# EAGLE schematic NESpi (EAGLE 7.7.0)
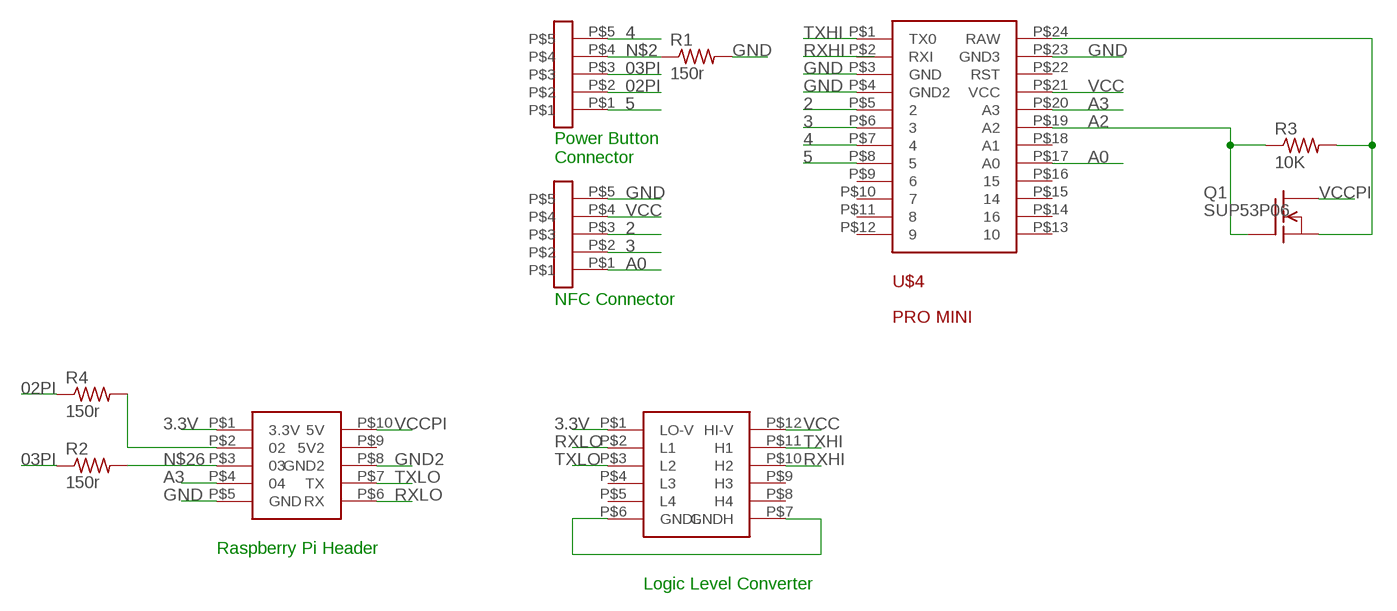
[diagram p0: schematic, sheet 1]

## Parts
Q1  SUP53P06  IRF620  [TO220]
R1  150r  R-US_VMTA55  [VMTA55]
R2  150r  R-US_VMTA55  [VMTA55]
R3  10K  R-US_VMTA55  [VMTA55]
R4  150r  R-US_VMTA55  [VMTA55]
U$1  DIP5  [DIP5]
U$3  DIP10  [DIP10]
U$4  PROMICRODIP24  [DIP24]
U$5  LEV_CONVERTER  [LEV_CONVERTER]
U$6  DIP5  [DIP5]

## Nets
2: U$4.P$5 U$6.P$3
02PI: R4.1 U$1.P$2
3: U$4.P$6 U$6.P$2
3.3V: U$3.P$1(3.3V) U$5.P$1(LO-V)
03PI: R2.1 U$1.P$3
4: U$1.P$5 U$4.P$7
5: U$1.P$1 U$4.P$8
A0: U$4.P$17(A0) U$6.P$1
A2: Q1.1(G) R3.1 U$4.P$19(A2)
A3: U$3.P$4 U$4.P$20(A3)
GND: R1.2 U$3.P$5(GND) U$4.P$3(GND) U$4.P$4(GND2) U$4.P$23(GND3) U$5.P$6(GNDL) U$5.P$7(GNDH) U$6.P$5
GND2: U$3.P$8(GND2)
N$1: R4.2 U$3.P$2
N$2: R1.1 U$1.P$4
N$13: Q1.3(S) R3.2 U$4.P$24(RAW)
N$26: R2.2 U$3.P$3
RXHI: U$5.P$10(H2)
RXLO: U$3.P$6(RX) U$5.P$2(L1)
TXHI: U$4.P$1(TX0) U$5.P$11(H1)
TXLO: U$3.P$7(TX) U$5.P$3(L2)
VCC: U$4.P$21(VCC) U$5.P$12(HI-V) U$6.P$4
VCCPI: Q1.2(D) U$3.P$10(5V)
Unconnected: U$3.P$9(5V2) U$4.P$2(RXI) U$4.P$9 U$4.P$10 U$4.P$11 U$4.P$12 U$4.P$13 U$4.P$14 U$4.P$15 U$4.P$16 U$4.P$18(A1) U$4.P$22(RST) U$5.P$4(L3) U$5.P$5(L4) U$5.P$8(H4) U$5.P$9(H3)

## Notes on the sheet
- Power Button
  Connector
- NFC Connector
- Raspberry Pi Header
- Logic Level Converter

## Library data of the parts
Q1 = transistor-fet:IRF620: N-Channel Enhancement MOSFET (HEXFET); 200V; 5,2A; 0,8Ohm
R1-R4 = resistor:R-US_: RESISTOR, American symbol
U$1 U$6 = femal_header_5_pin:DIP5
U$3 = femal_header_5x2_pin:DIP10
U$4 = ProMicro:PROMICRO
U$5 = Level_converter:LEV_CONVERTER